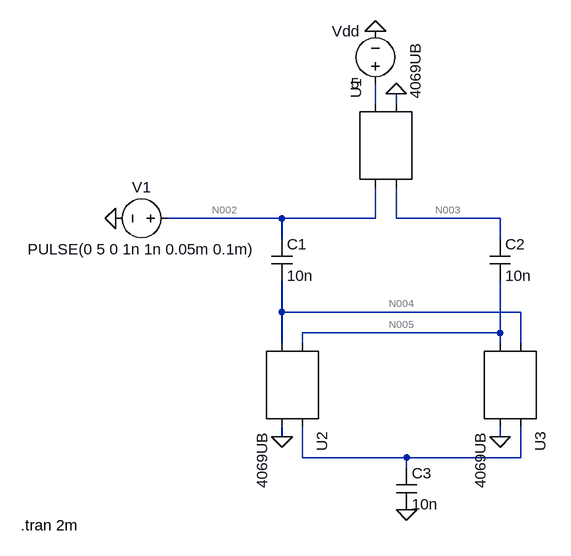
[diagram p0: schematic Draft1.asc]
* Draft1.asc
* U1: 4069UB (symbol AutoGenerated\4069UB not available, pins judged from their places): pin1=N002 pin2=N003 pin3=N001 pin4=0
* U2: 4069UB (symbol AutoGenerated\4069UB not available, pins judged from their places): pin1=N005 pin2=N004 pin3=N006 pin4=0
* U3: 4069UB (symbol AutoGenerated\4069UB not available, pins judged from their places): pin1=N004 pin2=N005 pin3=N006 pin4=0
V1 N002 0 PULSE(0 5 0 1n 1n 0.05m 0.1m)
Vdd N001 0 5
C1 N002 N004 10n
C2 N003 N005 10n
C3 N006 0 10n
.tran 2m
.backanno
.end

* Results of the author's LTspice run, read from the files saved beside the schematic
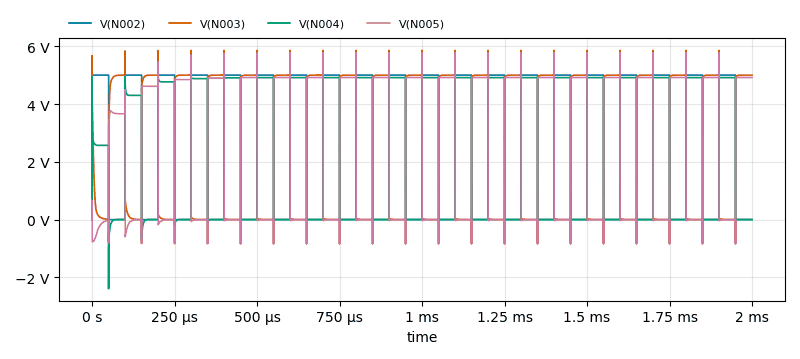
[diagram p1: Transient Analysis of Draft1.asc, plotted from the saved traces]
* Transient Analysis, 1 run:
*   V(N002): min 0 V, max 5 V, average 2.5 V, rms 3.536 V, last 0 V
*   V(N003): min -832.9 mV, max 5.856 V, average 2.507 V, rms 3.526 V, last 5 V
*   V(N004): min -2.395 V, max 4.965 V, average 2.376 V, rms 3.385 V, last 0 V
*   V(N005): min -833 mV, max 5.772 V, average 2.402 V, rms 3.42 V, last 4.916 V